# EasyEDA Pro project compute-module-v101.eprj, board mod-gravity
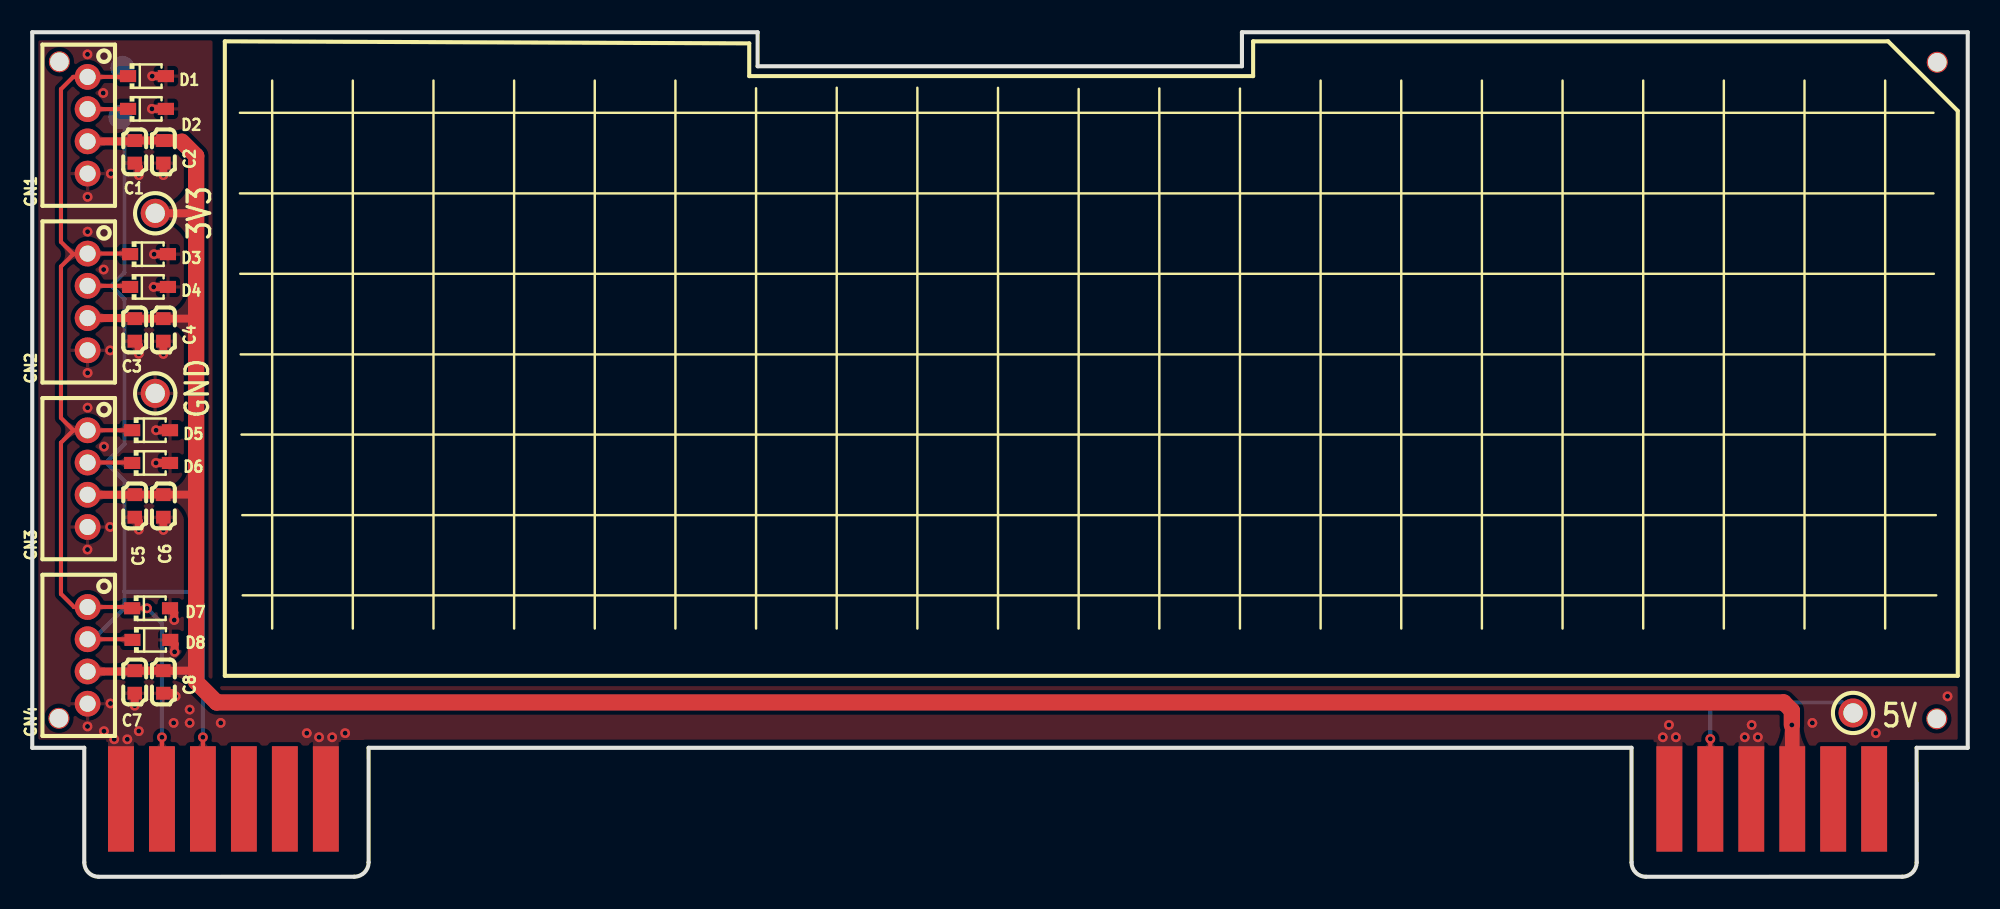
[diagram p14: board, top side]
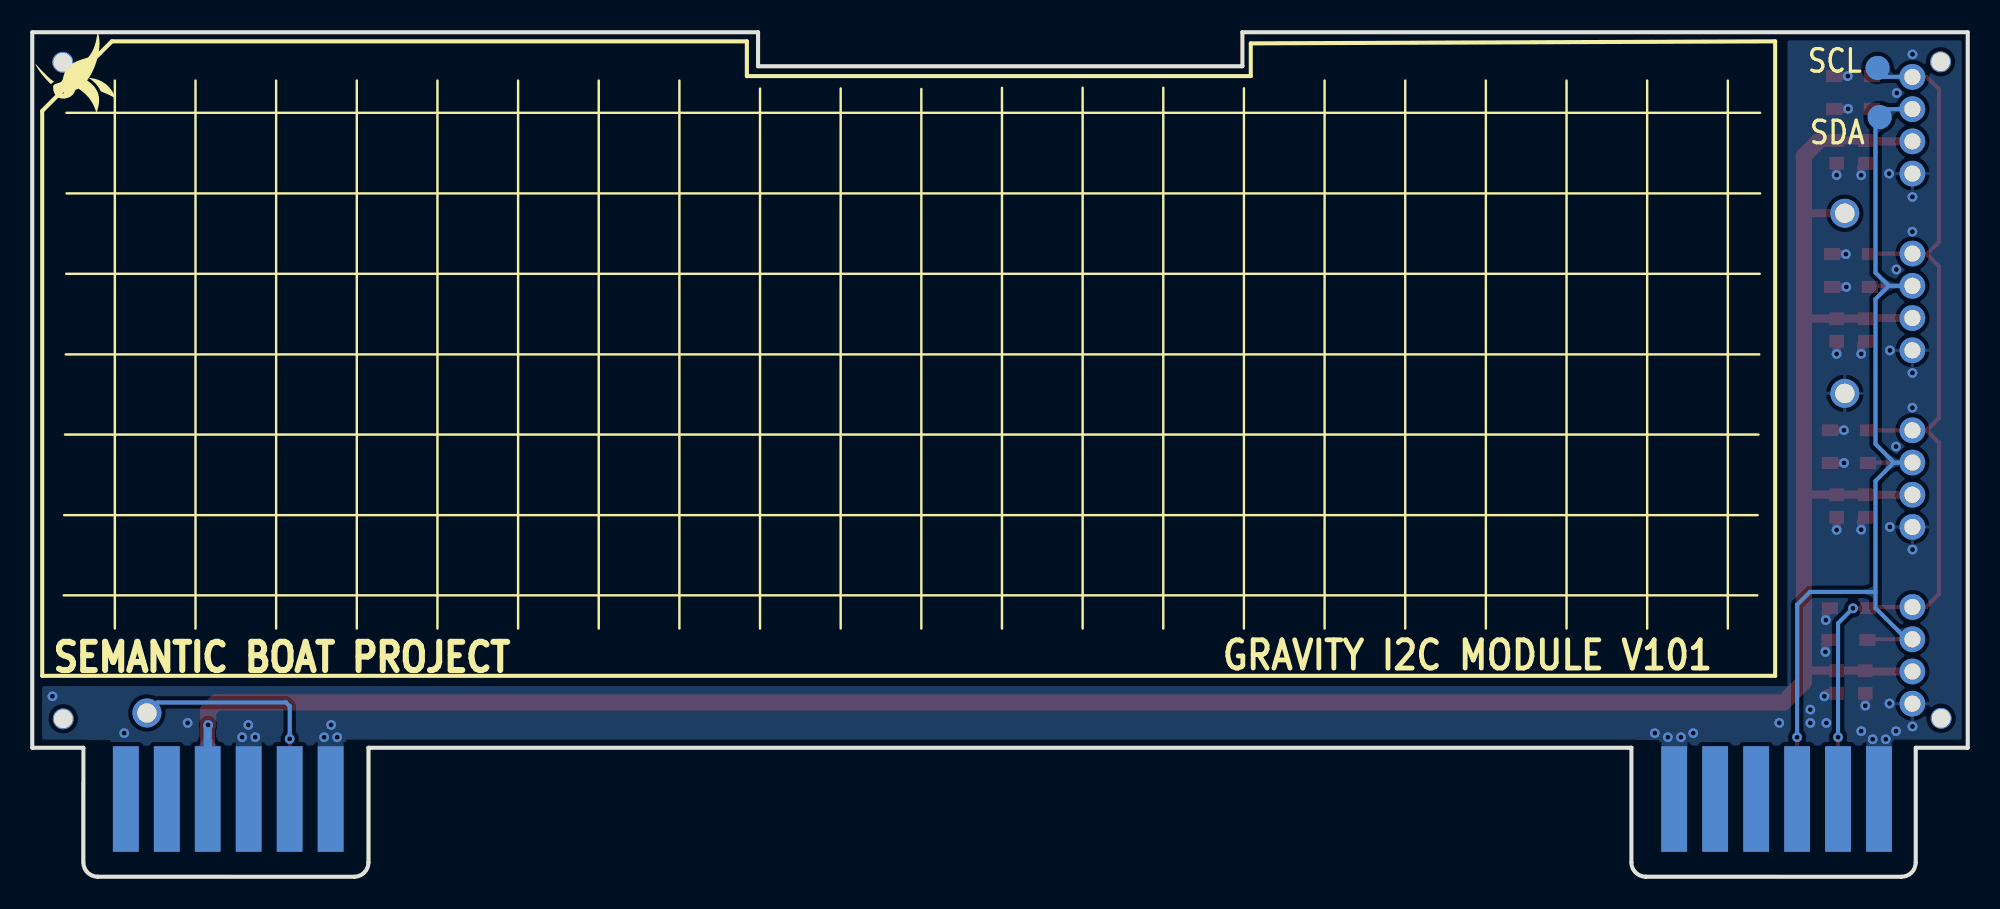
[diagram p15: board, bottom side, seen from below]

Outline 120 x 52.4 mm; copper layers: Top Layer, Bottom Layer. Coordinates in mm from the lower left corner of the outline.
Outline path: 0,52.4 44.97,52.4 44.97,50.29 75,50.29 75,52.4 120,52.4 120,8 116.83,8 116.83,0.89 arc(116.57,0.26) 115.94,0 100.04,0 arc(99.41,0.26) 99.16,0.89 99.16,8 20.85,8 20.85,0.89 arc(20.59,0.26) 19.96,0 4.11,0 arc(3.48,0.26) 3.22,0.89 3.22,8 0,8 0,52.4
Stack: Top Layer 0.035mm / Dielectric1 1.51mm FR4 er 4.5 / Bottom Layer 0.035mm

## Design rules (mm)
template: Custom Config
spacing copperThickness1oz (default): track to track 0.102, other pairs 0.152 to 0.3
spacing copperThickness2oz: track to track 0.203, other pairs 0.152 to 0.3
track width copperThickness1oz (default): min 0.127, default 0.254, max 2.54
track width copperThickness2oz: min 0.203, default 0.254, max 2.54
track width power: min 0.127, default 0.5, max 2.54
differential pair differentialPair (default): width min 0.127, default 0.254, max 2.54; gap min 0.152, default 0.152
via viaSize (default): diameter min 0.5, default 0.61, max 10; hole min 0.3, default 0.305, max 6.3
net GND uses power
net +3V3 uses power

## Placement (name value [footprint] x y rotation side)
C1  100nF  [C0603]  6.35 44.98 270 top
C2  10uF  [C0603]  8.13 44.98 270 top
C3  100nF  [C0603]  6.35 33.93 270 top
C4  10uF  [C0603]  8.13 33.93 270 top
C5  100nF  [C0603]  6.35 23.01 270 top
C6  10uF  [C0603]  8.13 23.01 270 top
C7  100nF  [C0603]  6.35 12.09 270 top
C8  10uF  [C0603]  8.13 12.09 270 top
CN1  B4B-PH-K-S(LF)(SN)  [CONN-TH_B4B-PH-K-S]  3.43 46.63 90 top
CN2  B4B-PH-K-S(LF)(SN)  [CONN-TH_B4B-PH-K-S]  3.43 35.67 90 top
CN3  B4B-PH-K-S(LF)(SN)  [CONN-TH_B4B-PH-K-S]  3.43 24.7 90 top
CN4  B4B-PH-K-S(LF)(SN)  [CONN-TH_B4B-PH-K-S]  3.43 13.74 90 top
D1  PESD5V0U1UA,115  [SOD-323_L1.8-W1.3-LS2.5-RD]  7.11 49.68 0 top
D2  PESD5V0U1UA,115  [SOD-323_L1.8-W1.3-LS2.5-RD]  7.11 47.65 0 top
D3  PESD5V0U1UA,115  [SOD-323_L1.8-W1.3-LS2.5-RD]  7.24 38.63 0 top
D4  PESD5V0U1UA,115  [SOD-323_L1.8-W1.3-LS2.5-RD]  7.24 36.6 0 top
D5  PESD5V0U1UA,115  [SOD-323_L1.8-W1.3-LS2.5-RD]  7.37 27.71 0 top
D6  PESD5V0U1UA,115  [SOD-323_L1.8-W1.3-LS2.5-RD]  7.37 25.68 0 top
D7  PESD5V0U1UA,115  [SOD-323_L1.8-W1.3-LS2.5-RD]  7.37 16.66 0 top
D8  PESD5V0U1UA,115  [SOD-323_L1.8-W1.3-LS2.5-RD]  7.38 14.7 0 top
NOREF  -  [Pad_e3]  1.68 50.57 270 top
NOREF#2  -  [Pad_e5]  118.08 9.8 90 top
NOREF#3  -  [Pad_e4]  118.11 50.54 180 top
NOREF#4  -  [Pad_e2]  1.65 9.83 0 top
TP1  -  [Test-Point-0.5mm]  5.59 50.19 180 bottom
TP2  -  [Test-Point-0.5mm]  5.46 47.14 180 bottom
TP3  RH-5004  [TESTPOINT_TH_BD2.5-D1.2]  7.62 29.99 270 top
TP4  RH-5004  [TESTPOINT_TH_BD2.5-D1.2]  7.62 41.17 270 top
TP5  RH-5004  [TESTPOINT_TH_BD2.5-D1.2]  112.89 10.16 0 top
U1  -  [ED12BGFBK-CARD]  107.88 0 0 top
U2  -  [ED12BGFBK-CARD]  11.88 0 0 top

## Footprints (pads in the part's own frame, mm; a bottom-side part is the same pattern mirrored in y, then rotated)
C0603
  rect 0.8x0.9 smd: 1(-0.7,0) 2(0.7,0)
CONN-TH_B4B-PH-K-S
  round 1.6 hole 1: 1(3,0) 2(1,0) 3(-1,0) 4(-3,0)
ED12BGFBK-CARD
  rect 1.6x6.54 smd far side: 1(-6.375,4.826) 2(-3.835,4.826) 3(-1.295,4.826) 4(1.245,4.826) 5(3.785,4.826) 6(6.325,4.826)
  rect 1.6x6.54 smd: 7(6.325,4.826) 8(3.785,4.826) 9(1.245,4.826) 10(-1.295,4.826) 11(-3.835,4.826) 12(-6.375,4.826)
Pad_e2
  round 1.3 hole 1.152: 1(0,0)
Pad_e3
  round 1.3 hole 1.152: 1(0,0)
Pad_e4
  round 1.3 hole 1.152: 1(0,0)
Pad_e5
  round 1.3 hole 1.152: 1(0,0)
SOD-323_L1.8-W1.3-LS2.5-RD
  rect 1x0.75 smd: 1(-1.173,0) 2(1.173,0)
Test-Point-0.5mm
  round 1.5 smd: 1(0,0)
TESTPOINT_TH_BD2.5-D1.2
  round 1.8 hole 1.2: 1(0,0)

## Nets
As in the schematic.

Pads without a net: NOREF 1; NOREF#2 1; NOREF#3 1; NOREF#4 1; U1 2 5 6 7 8; U2 2 3 4 5 8 9

## Via types
v1: diameter 0.61, hole 0.305, Top Layer to Bottom Layer, 56 vias

## Routing (per net, layer and track width the routed paths; a pad name or vN(x,y) marks a point on that pad's centre or on a via; arc(x,y) is an arc through that point)
+3V3: length 171.4
  Top Layer w0.5: TP4.1 10.03,41.17 ; CN2.3 6.32,34.67 C3.1 C4.1 9.85,34.63 9.91,34.69 ; CN1.3 6.3,45.63 C1.1 C2.1 ; 9.91,12.72 9.84,12.79 C8.1 C7.1 6.3,12.74 CN4.3 ; CN3.3 6.35,23.7 C5.1 C6.1 9.85,23.71 9.91,23.77
  Top Layer w0.754: 9.21,45.68 C2.1
  Top Layer w0.906: U1.4 109.12,9.39
  Top Layer w1.008: 9.27,45.61 10.16,44.73 10.16,12.09 11.43,10.82 108.59,10.82 109.09,10.31 v1(109.09,9.42)
  Bottom Layer w0.5: v1(109.09,9.42) 109.12,9.39 U1.4
+5V: length 15
  Top Layer w0.254: U1.11 v1(104.04,8.55)
  Bottom Layer w0.254: TP5.1 112.24,10.82 104.27,10.82 104.04,10.59 v1(104.04,8.55)
GND: length 13.5
  Top Layer w0.5: v1(7.53,36.6) D4.2 ; v1(7.55,38.63) D3.2 ; v1(7.67,25.68) D6.2 ; v1(8.13,21.52) C6.2 ; v1(6.61,32.45) 6.61,32.98 C3.2 ; C5.2 6.61,22.05 v1(6.61,21.53) ; v1(8.83,13.95) 8.83,14.43 D8.2 ; C8.2 8.7,11.39 v1(8.89,11.2) ; D7.2 8.8,16.4 v1(8.8,15.93) ; C1.2 6.61,44.03 v1(6.61,43.53) ; v1(7.42,47.65) D2.2 ; v1(7.43,49.68) D1.2 ; v1(7.68,27.71) D5.2 ; v1(8.13,32.44) C4.2 ; v1(8.13,43.53) C2.2 ; v1(6.35,10.61) C7.2
  vias: v1(3.42,51.03) v1(3.42,20.3) v1(3.42,9.33) v1(3.43,42.19) v1(3.43,40.03) v1(3.43,31.26) v1(3.43,29.1) v1(4.4,48.63) v1(4.42,37.68) v1(4.45,26.69) v1(4.45,9.04) v1(4.88,43.63) v1(4.83,32.66) v1(4.83,21.7) v1(4.85,10.75) v1(5.08,8.53) v1(5.89,8.53) v1(6.61,9.04) v1(8.77,9.55) v1(9.76,10.37) v1(9.76,9.55) v1(11.69,9.55) v1(17.02,8.91) v1(17.78,8.66) v1(18.59,8.66) v1(19.4,8.91) v1(101.09,8.66) v1(101.47,9.42) v1(101.91,8.66) v1(106.17,8.66) v1(106.6,9.42) v1(106.99,8.66) v1(110.37,9.55) v1(114.3,8.91) v1(118.75,11.2)
I2C_SCL: length 65
  Top Layer w0.254: 6.07,38.76 5.98,38.67 CN2.1 3.39,38.63 2.54,38.63 ; 2.55,27.7 1.78,26.93 1.78,17.55 2.59,16.74 CN4.1 6.12,16.74 D7.1 v1(7.11,16.66) ; 2.55,27.7 CN3.1 6.07,27.7 6.2,27.58 ; 2.55,27.7 1.78,28.47 1.78,37.87 2.54,38.63 ; 2.54,38.63 1.78,39.39 1.78,48.87 2.54,49.63 CN1.1 5.89,49.63 D1.1 ; U2.11 v1(8.04,8.66)
  Bottom Layer w0.254: v1(8.04,8.66) 8.04,15.73 v1(7.11,16.66) ; 5.97,50.19 5.42,49.63 CN1.1
I2C_SDA: length 68.5
  Top Layer w0.254: U2.10 v1(10.58,8.66) ; D2.1 5.93,47.63 CN1.2 ; CN3.2 6.17,25.7 D6.1 ; CN4.2 6.17,14.74 D8.1 ; CN2.2 6.01,36.67 6.07,36.72
  Bottom Layer w0.254: 4.57,25.7 5.72,24.56 5.72,17.71 ; 4.57,25.7 5.72,26.85 5.72,35.85 4.9,36.67 ; 4.57,25.7 CN3.2 ; TP2.1 5.72,46.88 5.72,37.49 4.9,36.67 ; CN1.2 5.35,47.63 5.84,47.14 ; 4.9,36.67 CN2.2 ; 5.72,17.71 5.75,17.67 9.78,17.67 10.58,16.88 v1(10.58,8.66) ; 5.72,17.71 5.72,16.66 3.79,14.74 CN4.2

## Copper pours and planes (outline as drawn; the poured copper is in the pictures)
GND on Top Layer: -1.52,53.49 122.56,53.49 122.56,6.37 -1.52,6.37
GND on Top Layer: 100.71,9.05 102.31,9.05 102.31,7.91 100.71,7.91
GND on Top Layer: 105.79,9.05 107.39,9.05 107.39,7.91 105.79,7.91
GND on Top Layer: 17.4,9.05 19,9.05 19,7.91 17.4,7.91
GND on Top Layer: 4.7,8.92 6.3,8.92 6.3,7.78 4.7,7.78
GND on Bottom Layer: 17.39,9.05 18.99,9.05 18.99,7.91 17.39,7.91
GND on Bottom Layer: 105.78,9.05 107.38,9.05 107.38,7.91 105.78,7.91
GND on Bottom Layer: -2.67,55.52 123.19,55.52 123.19,-3.28 -2.67,-3.28
GND on Bottom Layer: 100.7,9.05 102.3,9.05 102.3,7.91 100.7,7.91
GND on Bottom Layer: 4.69,8.93 6.29,8.93 6.29,7.78 4.69,7.78

Small or netless copper shapes (teardrops, artwork), in the pictures only: 82 on Top Layer, 18 on Bottom Layer

## Text on the board
Bottom Silkscreen Layer: SDA | SCL | GRAVITY I2C MODULE V101 | SEMANTIC BOAT PROJECT
Top Silkscreen Layer: 5V | GND | 3V3
